# EAGLE design DirSpd (EAGLE 9.6.2)
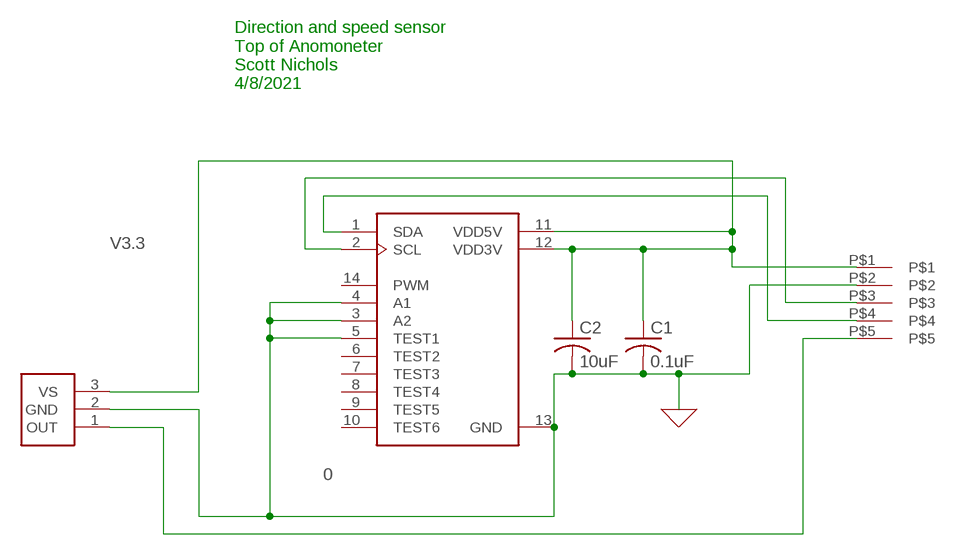
[diagram p0: schematic, sheet 1]

## Parts
C1  0.1uF  C-USC0805K  [C0805K]
C2  10uF  C-USC0805K  [C0805K]
J1  B05B-PASK  [B05B-PASK]
U1  AS5048B  [TSSOP14]
U2  SS451A  HONEYWELLSS451A  [TO-92-3]

## Nets
0: C1.2 C2.2 J1.P$2 U1.3(A2) U1.4(A1) U1.5(TEST1) U1.13(GND) U2.2(GND) ; supply symbol labelled GND
N$1: J1.P$5 U2.1(OUT)
N$5: J1.P$3 U1.2(SCL)
N$6: J1.P$4 U1.1(SDA)
V3.3: C1.1 C2.1 J1.P$1 U1.11(VDD5V) U1.12(VDD3V) U2.3(VS)
Unconnected: U1.6(TEST2) U1.7(TEST3) U1.8(TEST4) U1.9(TEST5) U1.10(TEST6) U1.14(PWM)

## Notes on the sheet
- Direction and speed sensor
  Top of Anomoneter
  Scott Nichols
  4/8/2021

## Library data of the parts
C1 C2 = rcl:C-US: CAPACITOR, American symbol; SPICEPREFIX: C
J1 = JST_Connectors_PA_Series:B05B-PASK: JST shrouded locking header, 2mm spacing, 5 pins, through hole.
U1 = WindAnometer:AS5048B
U2 = WindAnometer:HONEYWELLSS451A

## Board
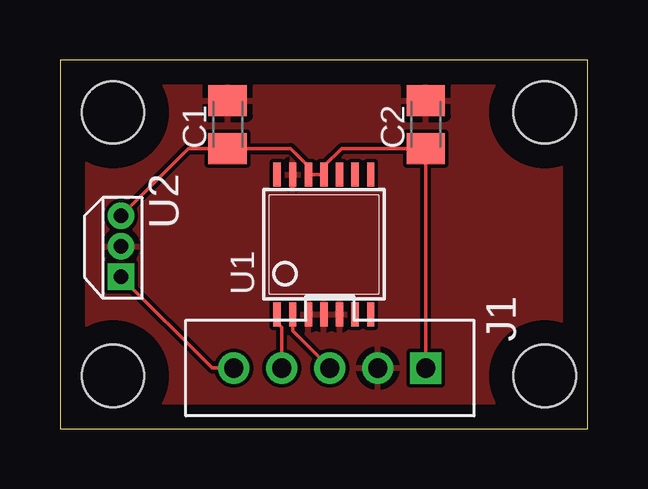
[diagram p1: board, top side]
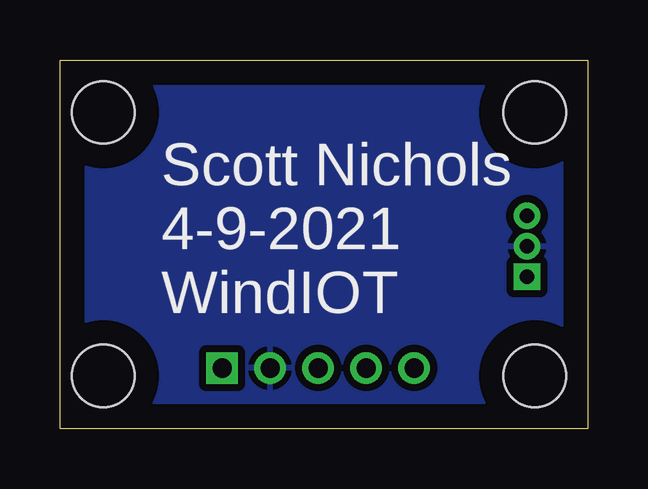
[diagram p2: board, bottom side, seen from below]

Size 22 x 15.39 mm. Coordinates in mm from the lower left corner, seen from the top.
Outline: 0,0 22,0 22,15.39 0,15.39 0,0
Copper layers (1*16): Top 0.035mm / dielectric 1.5mm / Bottom 0.035mm
Design rules "default": minimum track width 6mil, minimum drill 0.35mm, track to track 6mil, track to pad 6mil, pad to pad 6mil, via to via 6mil, smd to smd 6mil, copper to edge 40mil, drill to drill 6mil, minimum pad ring 10mil, minimum via ring 8mil, stop-mask expansion 4mil, vias tented up to drill 0mil, thermal gap 10mil
Holes 2.6 mm at 2.21,13.21 2.21,2.21 20.19,2.21 20.19,13.21

### Footprints (pad centres in the part's own frame; a part is rotated, then mirrored left to right if it is on the bottom)
C0805K = smd 1.3 x 1.6: 1 -1,0; 2 1,0
B05B-PASK = drill 0.8 square: P$1 0,0 | drill 0.8: P$2 0,-2; P$3 0,-4; P$4 0,-6; P$5 0,-8
TSSOP14 = smd 0.305 x 0.991: 1 -1.95,-2.918; 2 -1.3,-2.918; 3 -0.65,-2.918; 4 0,-2.918; 5 0.65,-2.918; 6 1.3,-2.918; 7 1.95,-2.918; 8 1.95,2.918; 9 1.3,2.918; 10 0.65,2.918; 11 0,2.918; 12 -0.65,2.918; 13 -1.3,2.918; 14 -1.95,2.918
TO-92-3 = drill 0.6 square: 1 1.27,0 | drill 0.6: 2 0,0; 3 -1.27,0

### Placement (x,y rotation side)
C1  6.99,12.7 90 top
C2  15.24,12.7 90 top
J1  15.24,2.54 270 top
U1  11,7.7 0 top
U2  2.54,7.62 270 top

### Tracks (layer width: path | path; a pad name or v marks a point on that pad's centre or on a via)
0
  Top 0.152: 9.7,10.12 U1.13 | 6.24,13.7 C1.2 | 9.7,10.27 U1.13 | 9.7,10.29 U1.13
  pour Bottom (isolate 0.305): 0,0 0,15.37 21.97,15.37 21.97,0
  pour Top: 0,0 21.97,0 21.97,15.37 0,15.37
N$1
  Top 0.152: J1.P$5 6.35,2.54 U2.1
N$5
  Top 0.152: J1.P$3 9.7,4.08 U1.2
N$6
  Top 0.152: J1.P$4 9.24,4.24 9.05,4.44 U1.1
V3.3
  Top 0.152: U2.3 5.35,11.7 C1.1 9.61,11.7 10.35,10.96 U1.12 U1.11 11,10.96 11.74,11.7 C2.1 J1.P$1

### Text on the board
bPlace: Scott Nichols / 4-9-2021 / WindIOT